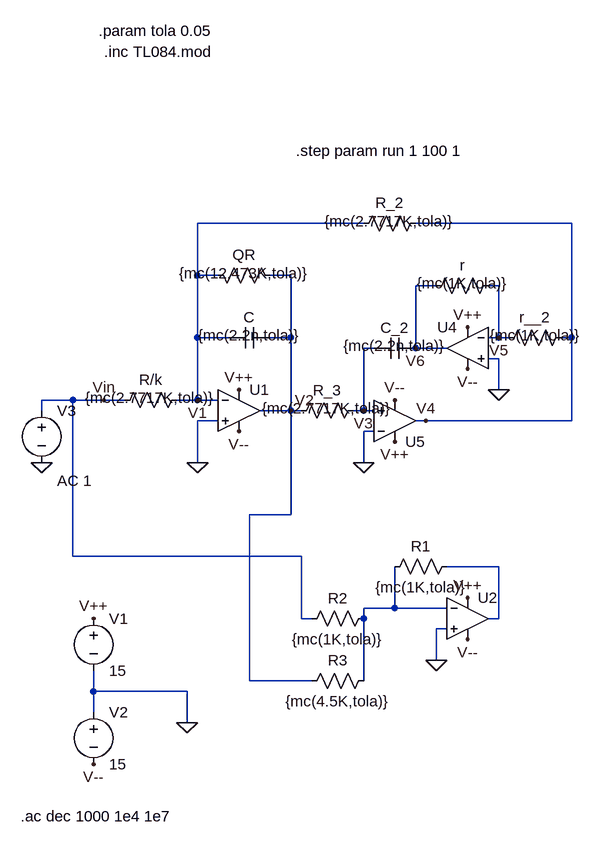
[diagram p0: schematic Ackberg_Mossberg (1).asc]
Ackberg_Mossberg (1).asc, the LTspice schematic file:
Version 4
SHEET 1 880 864
WIRE 304 -64 48 -64
WIRE 624 -64 384 -64
WIRE 48 16 48 -64
WIRE 80 16 48 16
WIRE 192 16 160 16
WIRE 416 32 384 32
WIRE 512 32 496 32
WIRE 48 112 48 16
WIRE 96 112 48 112
WIRE 192 112 192 16
WIRE 192 112 160 112
WIRE 512 112 512 32
WIRE 512 112 496 112
WIRE 528 112 512 112
WIRE 624 112 624 -64
WIRE 624 112 608 112
WIRE 320 128 304 128
WIRE 384 128 384 32
WIRE 432 128 384 128
WIRE 512 144 496 144
WIRE 512 192 512 144
WIRE -144 208 -192 208
WIRE -96 208 -144 208
WIRE -64 208 -96 208
WIRE 48 208 48 112
WIRE 48 208 16 208
WIRE 80 208 48 208
WIRE -192 224 -192 208
WIRE 192 224 192 112
WIRE 192 224 144 224
WIRE 208 224 192 224
WIRE 304 224 304 128
WIRE 304 224 288 224
WIRE 320 224 304 224
WIRE 80 240 48 240
WIRE 400 240 384 240
WIRE 624 240 624 112
WIRE 624 240 400 240
WIRE 320 256 304 256
WIRE 48 304 48 240
WIRE 304 304 304 256
WIRE 192 384 192 224
WIRE 192 384 128 384
WIRE -144 448 -144 208
WIRE 208 448 -144 448
WIRE 512 464 432 464
WIRE 352 528 352 464
WIRE 352 528 304 528
WIRE 432 528 352 528
WIRE 208 544 208 448
WIRE 224 544 208 544
WIRE 304 544 304 528
WIRE 512 544 512 464
WIRE 512 544 496 544
WIRE 432 560 416 560
WIRE 416 608 416 560
WIRE 128 640 128 384
WIRE 224 640 128 640
WIRE 304 640 304 544
WIRE -112 656 -112 624
WIRE 32 656 -112 656
WIRE -112 688 -112 656
WIRE 32 704 32 656
FLAG 304 304 0
FLAG 48 304 0
FLAG -96 208 Vin
FLAG 48 208 V1
FLAG 192 224 V2
FLAG 304 224 V3
FLAG 400 240 V4
FLAG 512 192 0
FLAG 512 112 V5
FLAG 384 128 V6
FLAG 32 704 0
FLAG 464 96 V++
FLAG -112 544 V++
FLAG -112 768 V--
FLAG 464 160 V--
FLAG -192 304 0
FLAG 112 192 V++
FLAG 112 256 V--
FLAG 352 272 V++
FLAG 352 208 V--
FLAG 416 608 0
FLAG 464 576 V--
FLAG 464 512 V++
SYMBOL res 32 192 R90
WINDOW 0 0 56 VBottom 2
WINDOW 3 28 56 VBottom 2
SYMATTR InstName R/k
SYMATTR Value {mc(2.7717K,tola)}
SYMBOL res 64 0 M90
WINDOW 0 0 56 VBottom 2
WINDOW 3 28 56 VBottom 2
SYMATTR InstName QR
SYMATTR Value {mc(12.473K,tola)}
SYMBOL cap 96 96 M90
WINDOW 0 0 32 VBottom 2
WINDOW 3 28 32 VBottom 2
SYMATTR InstName C
SYMATTR Value {mc(2.2n,tola)}
SYMBOL res 304 208 R90
WINDOW 0 0 56 VBottom 2
WINDOW 3 28 56 VBottom 2
SYMATTR InstName R_3
SYMATTR Value {mc(2.7717K,tola)}
SYMBOL cap 384 112 R90
WINDOW 0 0 32 VBottom 2
WINDOW 3 28 32 VBottom 2
SYMATTR InstName C_2
SYMATTR Value {mc(2.2n,tola)}
SYMBOL res 400 -80 R90
WINDOW 0 0 56 VBottom 2
WINDOW 3 28 56 VBottom 2
SYMATTR InstName R_2
SYMATTR Value {mc(2.7717K,tola)}
SYMBOL res 624 96 R90
WINDOW 0 0 56 VBottom 2
WINDOW 3 28 56 VBottom 2
SYMATTR InstName r__2
SYMATTR Value {mc(1K,tola)}
SYMBOL res 512 16 R90
WINDOW 0 0 56 VBottom 2
WINDOW 3 28 56 VBottom 2
SYMATTR InstName r
SYMATTR Value {mc(1K,tola)}
SYMBOL Opamps\\opamp2 464 64 M0
SYMATTR InstName U4
SYMATTR Value ""
SYMATTR SpiceModel TL084
SYMBOL voltage -112 528 R0
WINDOW 123 0 0 Left 2
WINDOW 39 0 0 Left 2
SYMATTR InstName V1
SYMATTR Value 15
SYMBOL voltage -112 672 R0
WINDOW 123 0 0 Left 2
WINDOW 39 0 0 Left 2
SYMATTR InstName V2
SYMATTR Value 15
SYMBOL voltage -192 208 R0
WINDOW 123 24 124 Left 2
WINDOW 39 0 0 Left 2
SYMATTR Value2 AC 1
SYMATTR InstName V3
SYMATTR Value ""
SYMBOL Opamps\\opamp2 112 160 R0
SYMATTR InstName U1
SYMATTR Value ""
SYMATTR SpiceModel TL084
SYMBOL Opamps\\opamp2 352 304 M180
SYMATTR InstName U5
SYMATTR Value ""
SYMATTR SpiceModel TL084
SYMBOL Opamps\\opamp2 464 480 R0
SYMATTR InstName U2
SYMATTR Value ""
SYMATTR SpiceModel TL084
SYMBOL res 448 448 R90
WINDOW 0 0 56 VBottom 2
WINDOW 3 32 56 VTop 2
SYMATTR InstName R1
SYMATTR Value {mc(1K,tola)}
SYMBOL res 320 528 R90
WINDOW 0 0 56 VBottom 2
WINDOW 3 32 56 VTop 2
SYMATTR InstName R2
SYMATTR Value {mc(1K,tola)}
SYMBOL res 320 624 R90
WINDOW 0 0 56 VBottom 2
WINDOW 3 32 56 VTop 2
SYMATTR InstName R3
SYMATTR Value {mc(4.5K,tola)}
TEXT -104 -360 Left 2 !.param tola 0.05
TEXT 200 -176 Left 2 !.step param run 1 100 1
TEXT -96 -328 Left 2 !.inc TL084.mod
TEXT -224 848 Left 2 !.ac dec 1000 1e4 1e7

The netlist it stands for:
* Ackberg_Mossberg (1).asc
R/k V1 Vin {mc(2.7717K,tola)}
R§QR V1 V2 {mc(12.473K,tola)}
C V1 V2 {mc(2.2n,tola)}
R_3 V3 V2 {mc(2.7717K,tola)}
C_2 V6 V3 {mc(2.2n,tola)}
R_2 V4 V1 {mc(2.7717K,tola)}
r__2 V4 V5 {mc(1K,tola)}
r V5 V6 {mc(1K,tola)}
XU4 0 V5 V++ V-- V6 TL084  ; pins In+ In- V+ V- OUT
V1 V++ 0 15
V2 0 V-- 15
V3 Vin 0 AC 1
XU1 0 V1 V++ V-- V2 TL084  ; pins In+ In- V+ V- OUT
XU5 V3 0 V++ V-- V4 TL084  ; pins In+ In- V+ V- OUT
XU2 0 N002 V++ V-- N001 TL084  ; pins In+ In- V+ V- OUT
R1 N001 N002 {mc(1K,tola)}
R2 N002 Vin {mc(1K,tola)}
R3 N002 V2 {mc(4.5K,tola)}
.param tola 0.05
.step param run 1 100 1
.inc TL084.mod
.ac dec 1000 1e4 1e7
.backanno
.end